# Altium schematic sheet ecs8a_sch.SchDoc
size A4
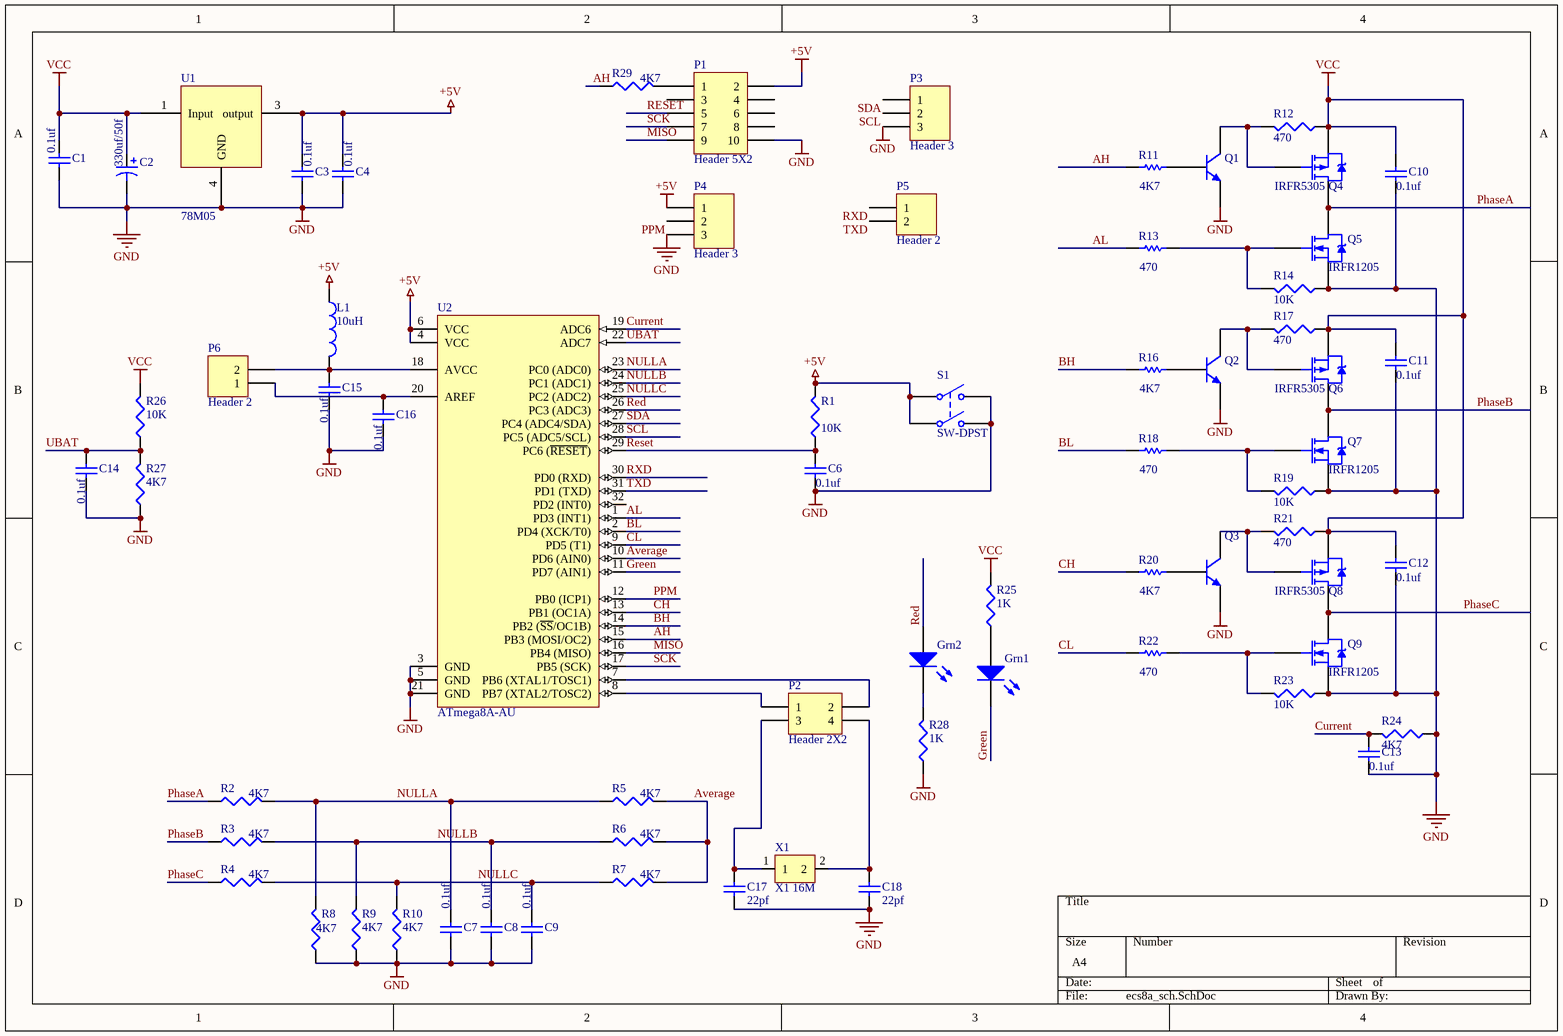
[diagram p0: ecs8a_sch.SchDoc]

## Parts
C1  value 0.1uf  [6-0805_M]  (hidden comment: Cap)
C2  value 330uf/50f  [RB7.6-15]  (hidden comment: Cap Pol1)
C3  value 0.1uf  [6-0805_M]  (hidden comment: Cap)
C4  value 0.1uf  [6-0805_M]  (hidden comment: Cap)
C6  value 0.1uf  [6-0805_M]  (hidden comment: Cap)
C7  value 0.1uf  [6-0805_M]  (hidden comment: Cap)
C8  value 0.1uf  [6-0805_M]  (hidden comment: Cap)
C9  value 0.1uf  [6-0805_M]  (hidden comment: Cap)
C10  value 0.1uf  [6-0805_M]  (hidden comment: Cap)
C11  value 0.1uf  [6-0805_M]  (hidden comment: Cap)
C12  value 0.1uf  [6-0805_M]  (hidden comment: Cap)
C13  value 0.1uf  [6-0805_M]  (hidden comment: Cap)
C14  value 0.1uf  [6-0805_M]  (hidden comment: Cap)
C15  value 0.1uf  [6-0805_M]  (hidden comment: Cap)
C16  value 0.1uf  [6-0805_M]  (hidden comment: Cap)
C17  value 22pf  [6-0805_M]  (hidden comment: Cap)
C18  value 22pf  [6-0805_M]  (hidden comment: Cap)
Grn1  LED0  [6-0805_M]  (value not drawn)
Grn2  LED0  [6-0805_M]  (value not drawn)
L1  value 10uH  [C1210_M]  (hidden comment: Inductor)
P1  Header 5X2  [HDR2X5]
P2  Header 2X2  [HDR2X2]
P3  Header 3  [HDR1X3]
P4  Header 3  [HDR1X3]
P5  Header 2  [HDR1X2]
P6  Header 2  [HDR1X2]
Q1  2N3904  [SOT23_M]  (value not drawn)
Q2  2N3904  [SOT23_M]  (value not drawn)
Q3  2N3904  [SOT23_M]  (value not drawn)
Q4  IRFR5305  [TO-252AA]
Q5  IRFR1205  [TO-252AA]
Q6  IRFR5305  [TO-252AA]
Q7  IRFR1205  [TO-252AA]
Q8  IRFR5305  [TO-252AA]
Q9  IRFR1205  [TO-252AA]
R1  value 10K  [6-0805_M]  (hidden comment: Res3)
R2  value 4K7  [6-0805_M]  (hidden comment: Res3)
R3  value 4K7  [6-0805_M]  (hidden comment: Res3)
R4  value 4K7  [6-0805_M]  (hidden comment: Res3)
R5  value 4K7  [6-0805_M]  (hidden comment: Res3)
R6  value 4K7  [6-0805_M]  (hidden comment: Res3)
R7  value 4K7  [6-0805_M]  (hidden comment: Res3)
R8  value 4K7  [6-0805_M]  (hidden comment: Res3)
R9  value 4K7  [6-0805_M]  (hidden comment: Res3)
R10  value 4K7  [6-0805_M]  (hidden comment: Res3)
R11  value 4K7  [6-0805_M]  (hidden comment: Res1)
R12  value 470  [6-0805_M]  (hidden comment: Res3)
R13  value 470  [6-0805_M]  (hidden comment: Res1)
R14  value 10K  [6-0805_M]  (hidden comment: Res3)
R16  value 4K7  [6-0805_M]  (hidden comment: Res1)
R17  value 470  [6-0805_M]  (hidden comment: Res3)
R18  value 470  [6-0805_M]  (hidden comment: Res1)
R19  value 10K  [6-0805_M]  (hidden comment: Res3)
R20  value 4K7  [6-0805_M]  (hidden comment: Res1)
R21  value 470  [6-0805_M]  (hidden comment: Res3)
R22  value 470  [6-0805_M]  (hidden comment: Res1)
R23  value 10K  [6-0805_M]  (hidden comment: Res3)
R24  value 4K7  [6-0805_M]  (hidden comment: Res3)
R25  value 1K  [6-0805_M]  (hidden comment: Res3)
R26  value 10K  [6-0805_M]  (hidden comment: Res3)
R27  value 4K7  [6-0805_M]  (hidden comment: Res3)
R28  value 1K  [6-0805_M]  (hidden comment: Res3)
R29  value 4K7  [6-0805_M]  (hidden comment: Res3)
S1  SW-DPST  [switch_4]
U1  78M05  [TO-252AA]
U2  ATmega8A-AU  [32A_M]
X1  X1 16M  [OSC]

## Nets
+5V: C3.2 C4.2 L1.1 P1.2 P4.1 R1.2 S1.1(COMMON1) S1.3(COMMON2) U1.3(output) U2.4(VCC) U2.6(VCC)
GND: C1.1 C2.2 C3.1 C4.1 C6.1 C7.2 C8.2 C9.2 C10.1 C11.1 C12.1 C13.1 C14.2 C15.2 C16.2 C17.2 C18.2 P1.10 P3.3 P4.3 Q1.1(E) Q2.1(E) Q3.1(E) Q5.3(S) Q7.3(S) Q9.3(S) R8.1 R9.1 R10.1 R14.1 R19.1 R23.1 R24.1 R27.1 R28.1 S1.2(NO1) S1.4(NO2) U1.4(GND) U2.3(GND) U2.5(GND) U2.21(GND)
VCC: C1.2 C2.1 C10.2 C11.2 C12.2 Q4.3(S) Q6.3(S) Q8.3(S) R12.1 R17.1 R21.1 R25.2 R26.2 U1.1(Input)
AH: R11.2 R29.1 U2.15(PB3_(MOSI/OC2))
AL: R13.2 U2.1(PD3_(INT1))
Average: R5.2 R6.2 R7.2 U2.10(PD6_(AIN0))
BH: R16.2 U2.14(PB2_(~{SS}/OC1B))
BL: R18.2 U2.2(PD4_(XCK/T0))
CH: R20.2 U2.13(PB1_(OC1A))
CL: R22.2 U2.9(PD5_(T1))
Current: C13.2 R24.2 U2.19(ADC6)
Green: Grn1.2(K) U2.11(PD7_(AIN1))
MISO: P1.9 U2.16(PB4_(MISO))
NULLA: C7.1 R2.2 R5.1 R8.2 U2.23(PC0_(ADC0))
NULLB: C8.1 R3.2 R6.1 R9.2 U2.24(PC1_(ADC1))
NULLC: C9.1 R4.2 R7.1 R10.2 U2.25(PC2_(ADC2))
PhaseA: Q4.4(D) Q5.4(D) R2.1
PhaseB: Q6.4(D) Q7.4(D) R3.1
PhaseC: Q8.4(D) Q9.4(D) R4.1
PPM: P4.2 U2.12(PB0_(ICP1))
Red: Grn2.1(A) U2.26(PC3_(ADC3))
Reset: C6.2 P1.5 R1.1 U2.29(PC6_(~{RESET}))
RXD: P5.1 U2.30(PD0_(RXD))
SCK: P1.7 U2.17(PB5_(SCK))
SCL: P3.2 U2.28(PC5_(ADC5/SCL))
SDA: P3.1 U2.27(PC4_(ADC4/SDA))
TXD: P5.2 U2.31(PD1_(TXD))
UBAT: C14.1 R26.1 R27.2 U2.22(ADC7)
NetC15_1: C15.1 L1.2 P6.2 U2.18(AVCC)
NetC16_1: C16.1 P6.1 U2.20(AREF)
NetC17_1: C17.1 P2.3 X1.1
NetC18_1: C18.1 P2.4 X1.2
NetGrn1_1: Grn1.1(A) R25.1
NetGrn2_2: Grn2.2(K) R28.2
NetP1_1: P1.1 R29.2
NetP2_1: P2.1 U2.8(PB7_(XTAL2/TOSC2))
NetP2_2: P2.2 U2.7(PB6_(XTAL1/TOSC1))
NetQ1_2: Q1.2(B) R11.1
NetQ1_3: Q1.3(C) Q4.1(G) R12.2
NetQ2_2: Q2.2(B) R16.1
NetQ2_3: Q2.3(C) Q6.1(G) R17.2
NetQ3_2: Q3.2(B) R20.1
NetQ3_3: Q3.3(C) Q8.1(G) R21.2
NetQ5_1: Q5.1(G) R13.1 R14.2
NetQ7_1: Q7.1(G) R18.1 R19.2
NetQ9_1: Q9.1(G) R22.1 R23.2

Not connected (* = marked no-connect by the designer): P1 3 4 6 8; U2 32(PD2_(INT0))

## Library data of the parts
C1 C3 C4 C6-C18 = Cap: Capacitor; Published: 8-Jun-2000; LatestRevisionDate: 17-Jul-2002; LatestRevisionNote: Re-released for DXP Platform.; PackageReference: RAD-0.3; Publisher: Altium Limited; PackageDescription: Radial Cap, Thru-Hole; 2 Leads; 0.3 in Pin Spacing
C2 = Cap Pol1: Polarized Capacitor (Radial); Published: 8-Jun-2000; LatestRevisionDate: 17-Jul-2002; LatestRevisionNote: Re-released for DXP Platform.; PackageReference: RB7.6-15; Publisher: Altium Limited; PackageDescription: Polarized Capacitor (Radial); 2 Leads
Grn1 Grn2 = LED0: Typical INFRARED GaAs LED; Published: 8-Jun-2000; LatestRevisionDate: 08-Jul-2005; LatestRevisionNote: Mech Layer 1 removed.; PackageReference: LED-0; Publisher: Altium Limited
L1 = Inductor: Code_IEC: 1005; Published: 8-Jun-2000; LatestRevisionDate: 17-Jul-2002; LatestRevisionNote: Re-released for DXP Platform.; PackageReference: 0402-A; Publisher: Altium Limited; Code_JEITA: 0402
P1 = Header 5X2: Header, 5-Pin, Dual row; LatestRevisionDate: 17-Jul-2002; LatestRevisionNote: Re-released for DXP Platform.; Publisher: Altium Limited
P2 = Header 2X2: Header, 2-Pin, Dual row; LatestRevisionDate: 17-Jul-2002; LatestRevisionNote: Re-released for DXP Platform.; Publisher: Altium Limited
P3 P4 = Header 3: Header, 3-Pin; LatestRevisionDate: 17-Jul-2002; LatestRevisionNote: Re-released for DXP Platform.; Publisher: Altium Limited
P5 P6 = Header 2: Header, 2-Pin; LatestRevisionDate: 17-Jul-2002; LatestRevisionNote: Re-released for DXP Platform.; Publisher: Altium Limited
Q1-Q3 = 2N3904: NPN General Purpose Amplifier; Published: 8-Jun-2000; LatestRevisionDate: 15-Jan-2003; LatestRevisionNote: PCB Footprint 'BCY-W3/D4.7' replaced; DatasheetVersion: 1997; PackageVersion: Sep-1998; PackageReference: TO-92A; Publisher: Altium Limited; PackageDescription: TO, Flat Index; 3 In-Line, Axial Leads; Body Dia. 4.5mm; Leads 0.51 x 0.48 mm (max); ComponentLink1Description: Manufacturer Link; ComponentLink1URL: http://www.fairchildsemi.com/; ComponentLink2Description: Datasheet; ComponentLink2URL: http://www.fairchildsemi.com/ds/2N%2F2N3904.pdf
Q4 Q6 Q8 = IRFR5305: HEXFET Power MOSFET; Manufacturer: International Rectifier; Class I: Discrete; Class II: MOSFET - Power; Note: Pin 2 is trimmed and is electrically connected to Drain.; Published: 8-Jun-2000; Revision: July-2002: Re-released for DXP Platform.; Datasheet: Latest Revision: PD-9.1402; Package Reference: TO-252AA; Publisher: Altium Limited
Q5 Q7 Q9 = IRFR1205: HEXFET Power MOSFET; Manufacturer: International Rectifier; Class I: Discrete; Class II: MOSFET - Power; Note: Pin 2 is trimmed and is electrically connected to Drain.; Published: 8-Jun-2000; Revision: July-2002: Re-released for DXP Platform.; Datasheet: Latest Revision: PD-91318B; Package Reference: TO-252AA; Publisher: Altium Limited
R1-R10 R12 R14 R17 R19 R21 R23-R29 = Res3: Resistor; Published: 8-Jun-2000; LatestRevisionDate: 29-May-2009; LatestRevisionNote: IPC-7351 Footprint Added.; PackageReference: J1-0603; Publisher: Altium Limited; PackageDescription: Chip Resistor
R11 R13 R16 R18 R20 R22 = Res1: Resistor; Published: 8-Jun-2000; LatestRevisionDate: 17-Jul-2002; LatestRevisionNote: Re-released for DXP Platform.; PackageReference: AXIAL-0.3; Publisher: Altium Limited; PackageDescription: Axial Device, Thru-Hole; 2 Leads; 0.3 in Pin Spacing
S1 = SW-DPST: Double-Pole, Single-Throw Switch; Published: 24-Mar-1999; LatestRevisionDate: 17-Jul-2002; LatestRevisionNote: Re-released for DXP Platform.; PackageReference: DPST-4; Publisher: Altium Limited; PackageDescription: Switch; 4 Leads
U1 X1 = Component_1
U2 = ATmega8A-AU: 8-bit AVR Microcontroller, 2.7-5.5V, 16MHz, 8KB Flash, 512 Bytes EEPROM, 1KB SRAM, 32-pin TQFP, Industrial Grade (-40癈 to 85癈); DatasheetVersion: revD, Feb-2011; PackageVersion: revC, Oct-2010; PackageReference: 32A; PackageDescription: 32-Lead, 7x7x1.0 mm Body, 0.8mm Lead Pitch, Thin Profile Plastic Quad Flat Package (TQFP); Code_JEDEC: MS-026-ABA; ComponentLink1Description: Manufacturer URL; ComponentLink1URL: http://www.atmel.com/; ComponentLink2Description: ATmega8A Datasheet; ComponentLink2URL: http://www.atmel.com/dyn/resources/prod_documents/doc8159.pdf; ComponentLink3Description: ATmega8A Summary; ComponentLink3URL: http://www.atmel.com/dyn/resources/prod_documents/8159S.pdf